# EAGLE design krajBB-Mojžiš_Matej_gerber (EAGLE 7.7.0)
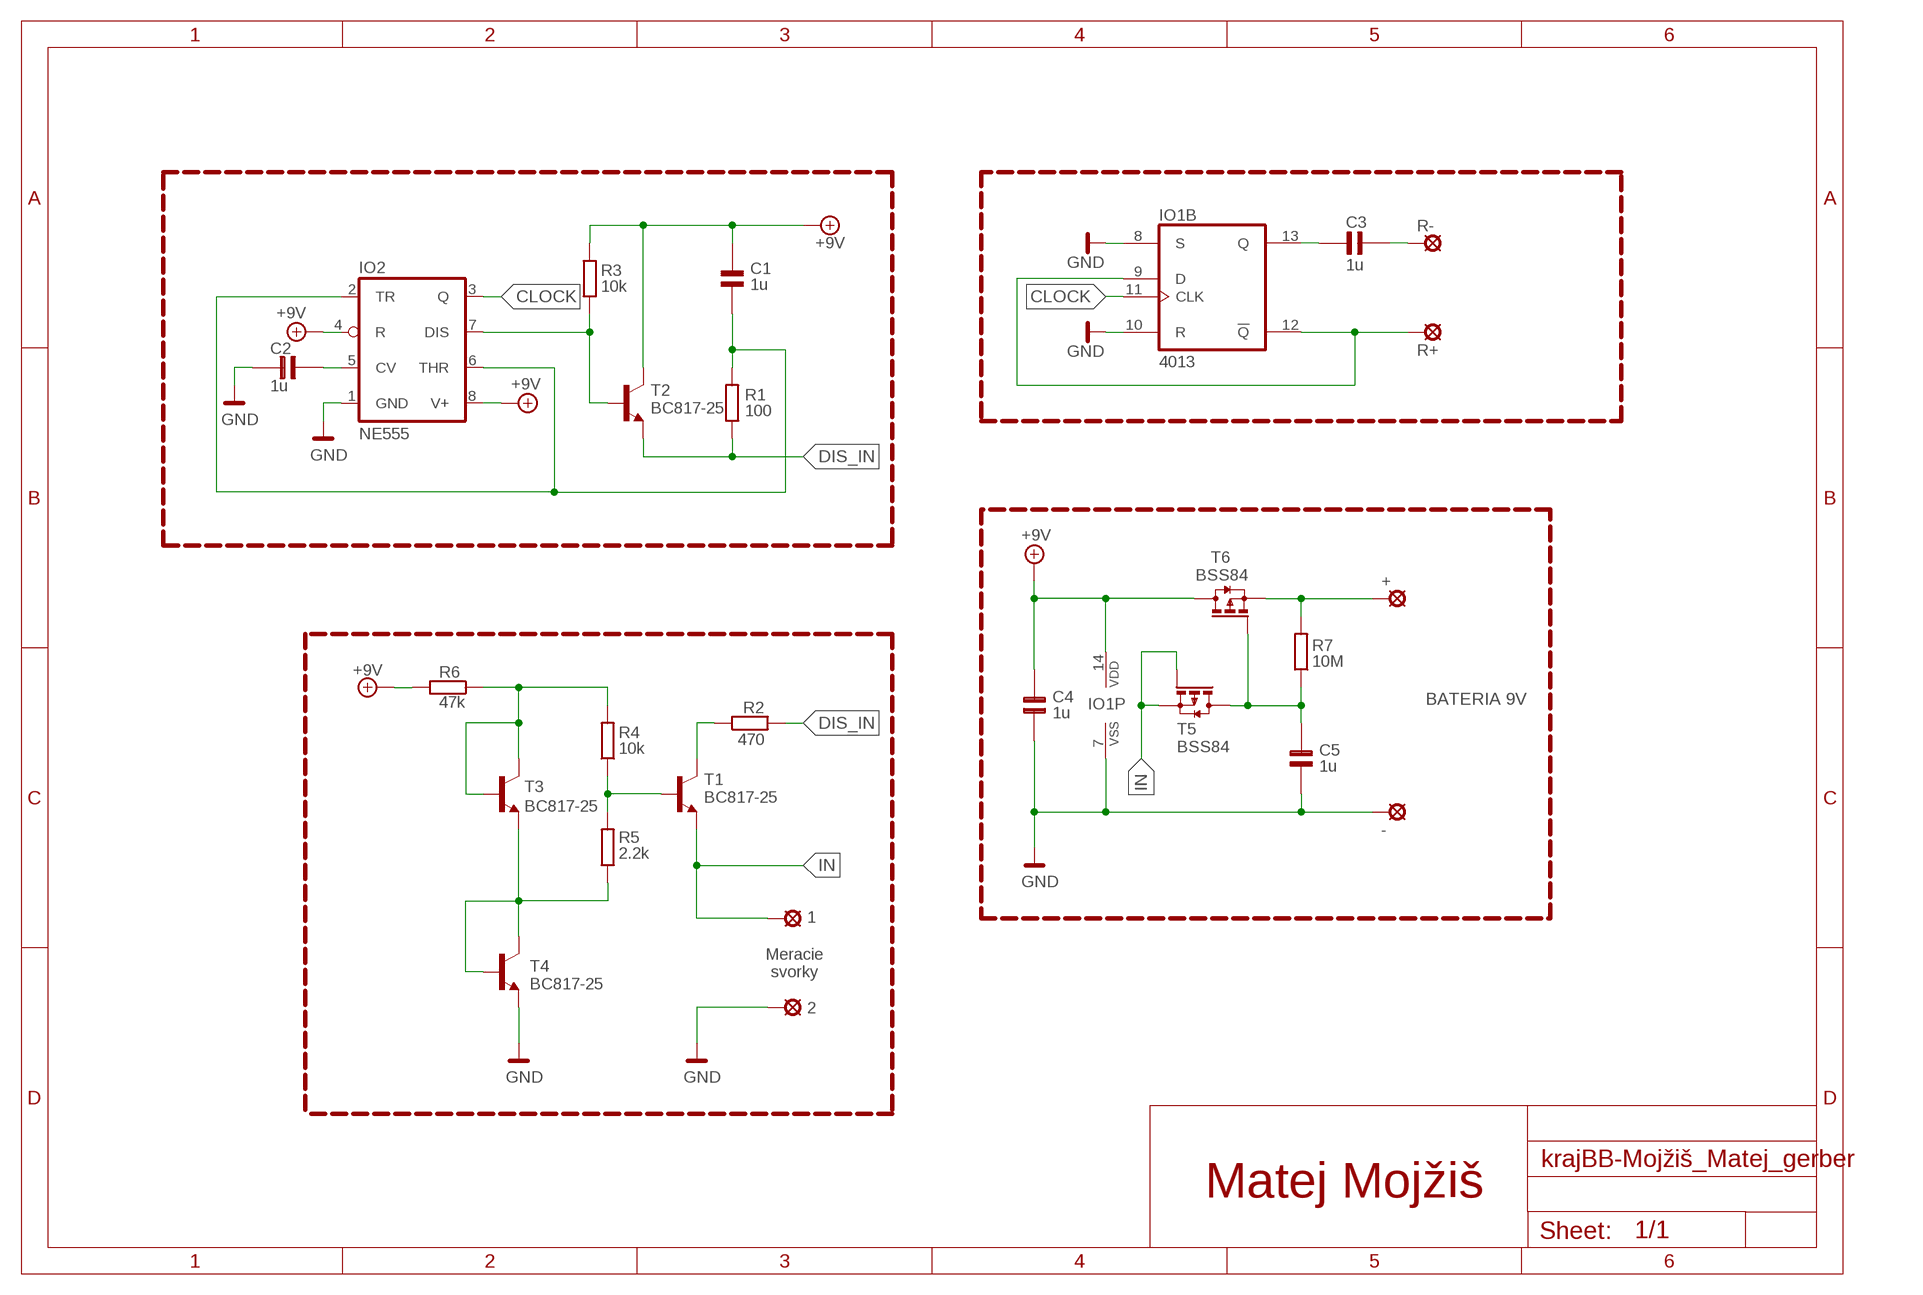
[diagram p0: schematic, sheet 1]

## Parts
1  SMD3X3  [SMD3X3]
2  SMD3X3  [SMD3X3]
+  SMD3X3  [SMD3X3]
-  SMD3X3  [SMD3X3]
C1  1u  C1206TOP  [1206]
C2  1u  C1206TOP  [1206]
C3  1u  C1206TOP  [1206]
C4  1u  C1206TOP  [1206]
C5  1u  C1206TOP  [1206]
IO1  4013  4013D  [SO14]
IO2  NE555  NE555D  [SO08]
R1  100  R1206TOP  [1206]
R2  470  R1206TOP  [1206]
R3  10k  R1206TOP  [1206]
R4  10k  R1206TOP  [1206]
R5  2.2k  R1206TOP  [1206]
R6  47k  R1206TOP  [1206]
R7  10M  R1206TOP  [1206]
R+  SMD3X3  [SMD3X3]
R-  SMD3X3  [SMD3X3]
T1  BC817-25  BC817-25SMD  [SOT23-BEC]
T2  BC817-25  BC817-25SMD  [SOT23-BEC]
T3  BC817-25  BC817-25SMD  [SOT23-BEC]
T4  BC817-25  BC817-25SMD  [SOT23-BEC]
T5  BSS84  [SOT23]
T6  BSS84  [SOT23]

## Nets
9V_1: R4.2 R6.1 T3.B T3.C
9V_2: R5.1 T3.E T4.B T4.C
+9V: C1.2 C4.2 IO1.14(P:VDD) IO2.4(R) IO2.8(V+) R3.2 R6.2 T2.C T6.3(D)
CLOCK: IO1.11(B:CLK) IO2.3(Q)
CV: C2.2 IO2.5(CV)
DIS: IO2.7(DIS) R3.1 T2.B
DIS_1: R2.1 T1.C
DIS_IN: R1.1 R2.2 T2.E
DIV: R4.1 R5.2 T1.B
GND: 2.P$1(MP) -.P$1(MP) C2.1 C4.1 C5.1 IO1.7(P:VSS) IO1.8(B:S) IO1.10(B:R) IO2.1(GND) T4.E
IN: 1.P$1(MP) T1.E T5.1(G) T5.2(S)
MOS: C5.2 R7.1 T5.3(D) T6.1(G)
OUT: C3.1 IO1.13(B:Q)
REP: C3.2 R-.P$1(MP)
REP+: IO1.9(B:D) IO1.12(B:!Q) R+.P$1(MP)
THR: C1.1 IO2.2(TR) IO2.6(THR) R1.2
VIN: +.P$1(MP) R7.2 T6.2(S)
Unconnected: IO1.1(A:Q) IO1.2(A:!Q) IO1.3(A:CLK) IO1.4(A:R) IO1.5(A:D) IO1.6(A:S)

## Notes on the sheet
- BATERIA 9V
- Meracie
  svorky
- Matej Mojžiš

## Library data of the parts
1 2 + - R+ R- = solpad:SMD3X3
C1-C5 = rcl:C1206: 1206 capacitor, top layer
IO1 = 40xx:4013: Dual D FLIP FLOP, set/reset
IO2 = linear:*555: TIMER
R1-R7 = rcl:R1206: 1206 resistor, top layer
T1-T4 = transistor-npn:BC817*: NPN Transistor
T5 T6 = transistor-small-signal:BSS84: P-CHANNEL MOS FET

## Board
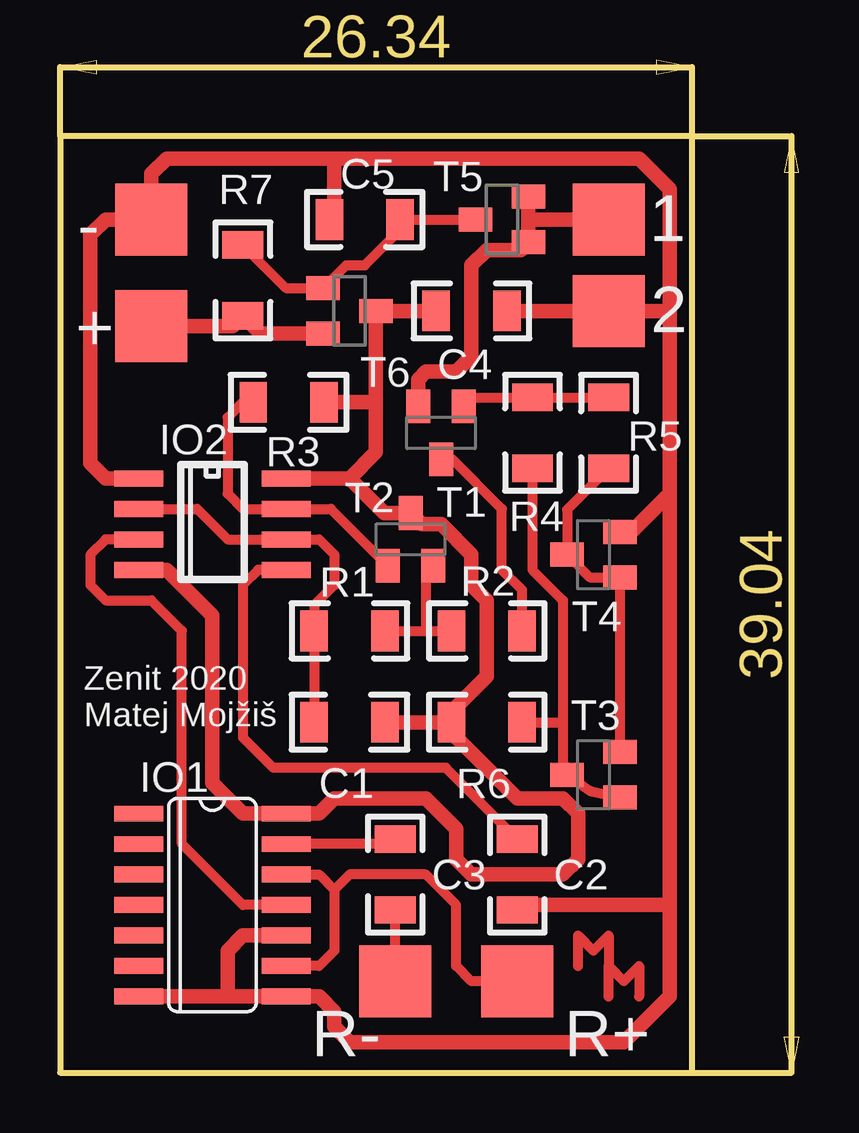
[diagram p1: board, top side]

Size 26.34 x 39.04 mm. Coordinates in mm from the lower left corner, seen from the top.
Outline: 0,0 26.34,0 26.34,39.04 0,39.04 0,0
Copper layers (1*16): Top 0.035mm / dielectric 1.5mm / Bottom 0.035mm
Design rules "default *": minimum track width 10mil, minimum drill 24mil, track to track 8mil, track to pad 8mil, pad to pad 8mil, via to via 8mil, smd to smd 8mil, copper to edge 16mil, drill to drill 8mil, minimum pad ring 10mil, minimum via ring 8mil, stop-mask expansion 4mil, vias tented up to drill 0mil, thermal gap 10mil

### Footprints (pad centres in the part's own frame; a part is rotated, then mirrored left to right if it is on the bottom)
SMD3X3 = smd 3 x 3: P$1 0,0
1206 = smd 1.143 x 1.702: 1 -1.473,0; 2 1.473,0
SO14 = smd 0.66 x 2.032: 1 -3.81,-3.073; 2 -2.54,-3.073; 3 -1.27,-3.073; 4 0,-3.073; 5 1.27,-3.073; 6 2.54,-3.073; 7 3.81,-3.073; 8 3.81,3.073; 9 2.54,3.073; 10 1.27,3.073; 11 0,3.073; 12 -1.27,3.073; 13 -2.54,3.073; 14 -3.81,3.073
SO08 = smd 0.66 x 2.032: 1 -1.905,-3.073; 2 -0.635,-3.073; 3 0.635,-3.073; 4 1.905,-3.073; 5 1.905,3.073; 6 0.635,3.073; 7 -0.635,3.073; 8 -1.905,3.073
SOT23-BEC = smd 1 x 1.4: B -0.95,-1.1; C 0,1.1; E 0.95,-1.1
SOT23 = smd 1 x 1.4: 1 -0.95,-1.1; 2 0.95,-1.1; 3 0,1.1

### Placement (x,y rotation side)
1  22.86,35.56 270 top
2  22.86,31.75 90 top
+  3.81,31.11 270 top
-  3.81,35.56 90 top
C1  12.06,14.61 0 top
C2  19.05,8.26 90 top
C3  13.97,8.26 270 top
C4  17.14,31.75 180 top
C5  12.7,35.56 0 top
IO1  6.35,6.99 270 top
IO2  6.35,22.86 270 top
R1  12.06,18.41 180 top
R2  17.78,18.41 180 top
R3  9.53,27.94 0 top
R4  19.68,26.67 270 top
R5  22.86,26.67 90 top
R6  17.78,14.61 180 top
R7  7.62,33.02 270 top
R+  19.05,3.81 90 top
R-  13.97,3.81 90 top
T1  15.88,26.67 180 top
T2  14.61,22.23 0 top
T3  22.23,12.41 90 top
T4  22.23,21.59 90 top
T5  18.41,35.56 90 top
T6  12.06,31.75 270 top

### Tracks (layer width: path | path; a pad name or v marks a point on that pad's centre or on a via)
9V_1
  Top 0.406: T3.C 22.07,11.75 T3.B | 21.12,12.73 T3.C | R4.2 19.68,20.95 20.95,19.68 20.95,14.61 | 20.95,14.61 20.95,12.87 T3.C | R6.1 20.95,14.61
9V_2
  Top 0.406: R5.1 21.12,23.46 T4.C 22.07,20.64 T4.B T3.E
+9V
  Top 0.61: C4.2 T6.3 13.16,27.94 | IO2.8 12.06,24.77 | 13.16,27.94 13.16,25.86 12.06,24.77 | R3.2 13.16,27.94 | IO2.4 4.45,20.95 6.35,19.05 6.35,12.06 7.62,10.79 IO1.14 10.79,10.79 11.43,11.43 15.24,11.43 16.51,10.16 16.51,8.89 17.14,8.26 20.95,8.26 21.59,8.89 21.59,10.79 20.95,11.43 19.05,11.43 16.31,14.17 R6.2 | C1.2 R6.2 | R6.2 16.31,15.04 17.78,16.51 17.78,19.68 17.14,20.32 17.14,21.59 15.88,22.86 15.07,22.86 T2.C 13.51,23.32 12.06,24.77
CLOCK
  Top 0.406: IO1.11 7.62,6.99 5.08,9.53 5.08,18.41 3.81,19.68 1.91,19.68 1.27,20.32 1.27,21.59 1.91,22.23 IO2.3
CV
  Top 0.406: IO2.5 8.26,20.95 7.62,20.32 7.62,13.97 8.89,12.7 16.08,12.7 C2.2
DIS
  Top 0.406: R3.1 7.62,27.94 6.99,27.3 6.99,24.13 7.62,23.5 IO2.7 11.29,23.5 T2.B
DIS_1
  Top 0.406: R2.1 19.25,20.12 18.41,20.95 18.41,23.5 16.34,25.57 T1.C
DIS_IN
  Top 0.406: 13.51,18.45 R1.1 15.24,18.41 | 15.24,18.41 R2.2 | T2.E 15.24,20.81 15.24,18.41
DIV
  Top 0.406: R5.2 R4.1 17.2,28.14 T1.B
GND
  Top 0.61: 11.43,38.1 4.45,38.1 3.81,37.47 -.P$1 1.91,35.56 1.27,34.92 1.27,25.4 1.91,24.77 IO2.1 | 11.43,38.1 24.13,38.1 25.4,36.83 25.4,31.75 | 25.4,31.75 25.4,24.13 | 25.4,24.13 23.81,22.54 T4.E | C4.1 2.P$1 25.4,31.75 | C5.1 11.43,35.76 11.43,38.1 | IO1.7 6.99,3.17 | 6.99,3.17 IO1.8 10.79,3.17 11.43,2.54 11.43,1.91 12.06,1.27 23.5,1.27 25.4,3.17 25.4,6.99 | IO1.10 7.62,5.71 6.99,5.08 6.99,3.17 | 25.4,6.99 25.4,24.13 | C2.1 19.25,6.99 25.4,6.99
ID
  Top 0.406: 21.59,4.45 21.59,5.71 22.23,5.08 22.86,5.71 22.86,4.45 | 22.86,3.17 22.86,4.45 | 22.86,4.45 23.5,3.81 24.13,4.45 24.13,3.17
IN
  Top 0.61: T5.2 19.52,35.56 | 19.52,35.56 T5.1 19.2,34.29 17.78,34.29 17.14,33.66 17.14,29.84 16.51,29.21 15.24,29.21 14.93,28.89 T1.E | 1.P$1 19.52,35.56
MOS
  Top 0.406: R7.1 9.41,32.7 T6.1 11.92,33.66 12.7,33.66 14.17,35.13 C5.2 T5.3
OUT
  Top 0.406: C3.1 13.77,9.53 IO1.13
REP
  Top 0.406: R-.P$1 C3.2
REP+
  Top 0.406: IO1.12 10.79,8.26 11.43,7.62 | 11.43,7.62 11.43,5.08 10.79,4.45 IO1.9 | R+.P$1 17.14,3.81 16.51,4.45 16.51,6.99 15.24,8.26 12.06,8.26 11.43,7.62
THR
  Top 0.406: IO2.2 5.71,23.5 6.99,22.23 IO2.6 10.79,22.23 11.43,21.59 11.43,20.32 10.59,19.48 R1.2 C1.1
VIN
  Top 0.61: +.P$1 7.19,31.11 R7.2 8.37,30.8 T6.2

### Text on the board
tNames: Zenit 2020 / Matej Mojžiš